# EAGLE design ControlPCB (EAGLE 9.6.2)
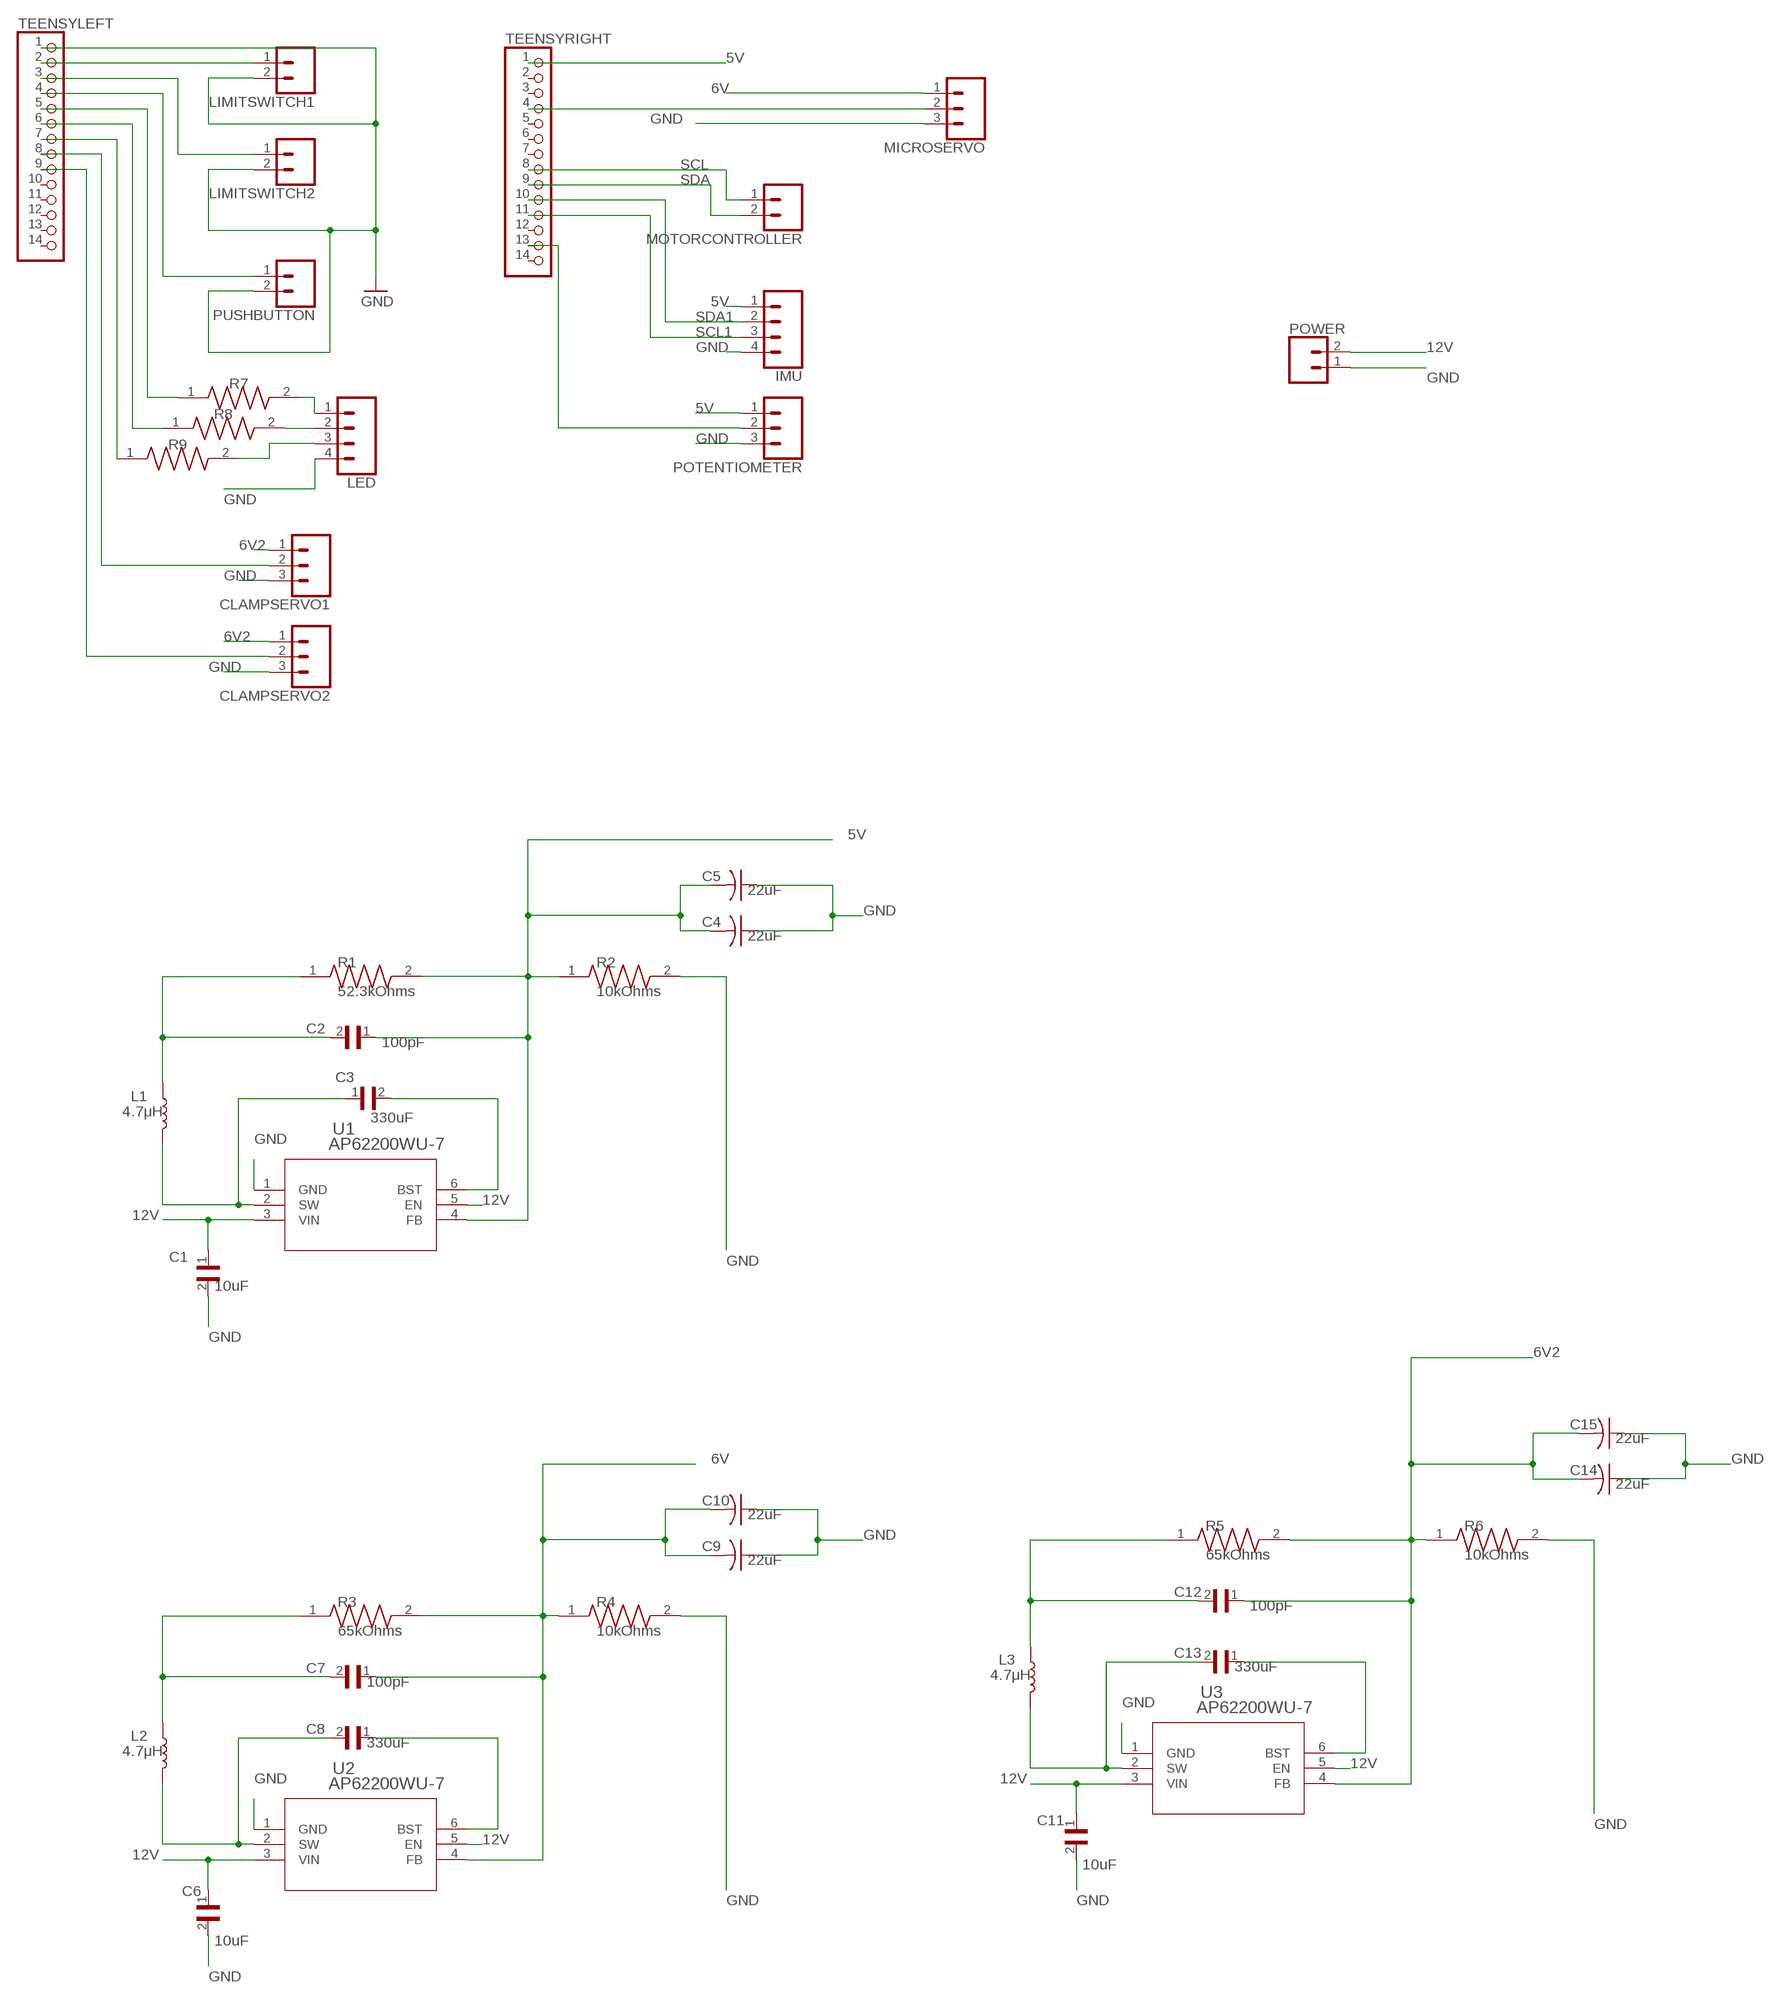
[diagram p0: schematic, sheet 1]

## Parts
C1  10uF  JMK107BJ106MA-T  [CAPC1608X90N]
C2  100pF  GRM033R71E101KA01D  [CAPC0603X33N]
C3  330uF  GRM32EC80E337ME05K  [CAPC3225X280N]
C4  22uF  C-USC0402  [C0402]
C5  22uF  C-USC0402  [C0402]
C6  10uF  JMK107BJ106MA-T  [CAPC1608X90N]
C7  100pF  GRM033R71E101KA01D  [CAPC0603X33N]
C8  330uF  GRM32EC80E337ME05K  [CAPC3225X280N]
C9  22uF  C-USC0402  [C0402]
C10  22uF  C-USC0402  [C0402]
C11  10uF  JMK107BJ106MA-T  [CAPC1608X90N]
C12  100pF  GRM033R71E101KA01D  [CAPC0603X33N]
C13  330uF  GRM32EC80E337ME05K  [CAPC3225X280N]
C14  22uF  C-USC0402  [C0402]
C15  22uF  C-USC0402  [C0402]
CLAMPSERVO1  CONN_03SCREW  [SCREWTERMINAL-3.5MM-3]
CLAMPSERVO2  CONN_03SCREW  [SCREWTERMINAL-3.5MM-3]
IMU  CONN_04SCREW  [SCREWTERMINAL-3.5MM-4]
L1  4.7μH  4.7μH_SHIELDED_INDUCTORNPIS_LS  [INDUCTOR_4X4MM]
L2  4.7μH  4.7μH_SHIELDED_INDUCTORNPIS_LS  [INDUCTOR_4X4MM]
L3  4.7μH  4.7μH_SHIELDED_INDUCTORNPIS_LS  [INDUCTOR_4X4MM]
LED  CONN_04SCREW  [SCREWTERMINAL-3.5MM-4]
LIMITSWITCH1  CONN_023.5MM  [SCREWTERMINAL-3.5MM-2]
LIMITSWITCH2  CONN_023.5MM  [SCREWTERMINAL-3.5MM-2]
MICROSERVO  CONN_03SCREW  [SCREWTERMINAL-3.5MM-3]
MOTORCONTROLLER  CONN_023.5MM  [SCREWTERMINAL-3.5MM-2]
POTENTIOMETER  CONN_03SCREW  [SCREWTERMINAL-3.5MM-3]
POWER  CONN_023.5MM  [SCREWTERMINAL-3.5MM-2]
PUSHBUTTON  CONN_023.5MM  [SCREWTERMINAL-3.5MM-2]
R1  52.3kOhms  ERJ1GNF1000C  [RES_ERJ1GNF1000C]
R2  10kOhms  ERJ1GNF1000C  [RES_ERJ1GNF1000C]
R3  65kOhms  ERJ1GNF1000C  [RES_ERJ1GNF1000C]
R4  10kOhms  ERJ1GNF1000C  [RES_ERJ1GNF1000C]
R5  65kOhms  ERJ1GNF1000C  [RES_ERJ1GNF1000C]
R6  10kOhms  ERJ1GNF1000C  [RES_ERJ1GNF1000C]
R7  100Ohm  ERJ1GNF1000C  [RES_ERJ1GNF1000C]
R8  100Ohm  ERJ1GNF1000C  [RES_ERJ1GNF1000C]
R9  100Ohm  ERJ1GNF1000C  [RES_ERJ1GNF1000C]
TEENSYLEFT  PINHD-1X14  [1X14]
TEENSYRIGHT  PINHD-1X14  [1X14]
U1  AP62200WU-7  [TSOT26-WU_DIO]
U2  AP62200WU-7  [TSOT26-WU_DIO]
U3  AP62200WU-7  [TSOT26-WU_DIO]

## Nets
5V: C2.1 C4.2 C5.2 IMU.1 POTENTIOMETER.1 R1.2 R2.1 TEENSYRIGHT.1 U1.4(FB)
6V: C7.1 C9.2 C10.2 MICROSERVO.1 R3.2 R4.1 U2.4(FB)
6V2: C12.1 C14.2 C15.2 CLAMPSERVO1.1 CLAMPSERVO2.1 R5.2 R6.1 U3.4(FB)
12V: C1.1 C6.1 C11.1 POWER.2 U1.3(VIN) U1.5(EN) U2.3(VIN) U2.5(EN) U3.3(VIN) U3.5(EN)
GND: C1.2 C4.1 C5.1 C6.2 C9.1 C10.1 C11.2 C14.1 C15.1 CLAMPSERVO1.3 CLAMPSERVO2.3 IMU.4 LED.4 LIMITSWITCH1.2 LIMITSWITCH2.2 MICROSERVO.3 POTENTIOMETER.3 POWER.1 PUSHBUTTON.2 R2.2 R4.2 R6.2 TEENSYLEFT.1 U1.1(GND) U2.1(GND) U3.1(GND)
N$1: LIMITSWITCH1.1 TEENSYLEFT.2
N$2: LIMITSWITCH2.1 TEENSYLEFT.3
N$3: PUSHBUTTON.1 TEENSYLEFT.4
N$4: MICROSERVO.2 TEENSYRIGHT.4
N$5: R7.1 TEENSYLEFT.5
N$6: R8.1 TEENSYLEFT.6
N$7: R9.1 TEENSYLEFT.7
N$8: CLAMPSERVO1.2 TEENSYLEFT.8
N$9: C2.2 L1.P$1 R1.1
N$10: C3.1 L1.P$2 U1.2(SW)
N$11: CLAMPSERVO2.2 TEENSYLEFT.9
N$12: C3.2 U1.6(BST)
N$13: C7.2 L2.P$1 R3.1
N$14: C8.2 L2.P$2 U2.2(SW)
N$15: POTENTIOMETER.2 TEENSYRIGHT.13
N$16: C8.1 U2.6(BST)
N$17: C12.2 L3.P$1 R5.1
N$18: C13.2 L3.P$2 U3.2(SW)
N$19: LED.1 R7.2
N$20: LED.2 R8.2
N$21: LED.3 R9.2
N$22: C13.1 U3.6(BST)
SCL: MOTORCONTROLLER.1 TEENSYRIGHT.8
SCL1: IMU.3 TEENSYRIGHT.11
SDA: MOTORCONTROLLER.2 TEENSYRIGHT.9
SDA1: IMU.2 TEENSYRIGHT.10
Unconnected: TEENSYLEFT.10 TEENSYLEFT.11 TEENSYLEFT.12 TEENSYLEFT.13 TEENSYLEFT.14 TEENSYRIGHT.2 TEENSYRIGHT.3 TEENSYRIGHT.5 TEENSYRIGHT.6 TEENSYRIGHT.7 TEENSYRIGHT.12 TEENSYRIGHT.14

## Library data of the parts
C1 C6 C11 = Capacitor10uF:JMK107BJ106MA-T: CAP SMT CER 10UF 6.3V 20% 0603 TAPE
C2 C7 C12 = Capacitor100pF:GRM033R71E101KA01D: SMD Capacitor X7R(EIA) with Capacitance: 100pF Tol. 10%. Rated Voltage: 25Vdc
C3 C8 C13 = GRM32EC80E337ME05K:GRM32EC80E337ME05K: SMD Capacitor X6S(EIA) with Capacitance: 330uF Tol. 20%. Rated Voltage: 2.5Vdc
C4 C5 C9 C10 C14 C15 = rcl:C-US: CAPACITOR, American symbol; SPICEPREFIX: C
CLAMPSERVO1 CLAMPSERVO2 MICROSERVO POTENTIOMETER = SparkFun-Connectors:CONN_03: Multi connection point. Often used as Generic Header-pin footprint for 0.1 inch spaced/style header connections On any of the 0.1 inch spaced packages, you can populate with these: Break Away Headers - Straight <https://www.sparkfun.com/products/116> (PRT-00116) Break Away Male Headers - Right Angle <https://www.sparkfun.com/products/553> (PRT-00553) Female Headers <https://www.sparkfun.com/products/115> (PRT-00115) Break Away Headers - Machine Pin <https://www.sparkfun.com/products/117> (PRT-00117) Break Away Female Headers - Swiss Machine Pin <https://www.sparkfun.com/products/743> (PRT-00743) Stackable Header - 3 Pin (Female, 0.1") <https://www.sparkfun.com/products/13875> (PRT-13875) For SCREWTERMINALS and SPRING TERMINALS visit here: Screw Terimnals on SparkFun.com <https://www.sparkfun.com/search/results?term=Screw+Terminals> (5mm/3.5mm/2.54mm spacing) This device is also useful as a general connection point to wire up your design to another part of your project. Our various solder wires solder well into these plated through hole pads. Hook-Up Wire - Assortment (Stranded, 22 AWG) <https://www.sparkfun.com/products/11375> (PRT-11375) Hook-Up Wire - Assortment (Solid Core, 22 AWG) <https://www.sparkfun.com/products/11367> (PRT-11367) View the entire wire category on our website here <https://www.sparkfun.com/categories/141> Special notes: Molex polarized connector foot print use with SKU : PRT-08232 with associated crimp pins and housings.; PROD_ID: CONN-08288; SF_ID: PRT-08235
IMU LED = SparkFun-Connectors:CONN_04: Multi connection point. Often used as Generic Header-pin footprint for 0.1 inch spaced/style header connections On any of the 0.1 inch spaced packages, you can populate with these: Break Away Headers - Straight <https://www.sparkfun.com/products/116> (PRT-00116) Break Away Male Headers - Right Angle <https://www.sparkfun.com/products/553> (PRT-00553) Female Headers <https://www.sparkfun.com/products/115> (PRT-00115) Break Away Headers - Machine Pin <https://www.sparkfun.com/products/117> (PRT-00117) Break Away Female Headers - Swiss Machine Pin <https://www.sparkfun.com/products/743> (PRT-00743) For SCREWTERMINALS and SPRING TERMINALS visit here: Screw Terimnals on SparkFun.com <https://www.sparkfun.com/search/results?term=Screw+Terminals> (5mm/3.5mm/2.54mm spacing) This device is also useful as a general connection point to wire up your design to another part of your project. Our various solder wires solder well into these plated through hole pads. Hook-Up Wire - Assortment (Stranded, 22 AWG) <https://www.sparkfun.com/products/11375> (PRT-11375) Hook-Up Wire - Assortment (Solid Core, 22 AWG) <https://www.sparkfun.com/products/11367> (PRT-11367) View the entire wire category on our website here <https://www.sparkfun.com/categories/141> Special notes: Molex polarized connector foot print use with SKU : PRT-08231 with associated crimp pins and housings. 1MM SMD Version SKU: PRT-10208; PROD_ID: CONN-14485
L1-L3 = SparkFun-Coils:4.7μH_SHIELDED_INDUCTOR: 4.7uH Inductor 4.7uH 1.4A 50mOhm 1008(2520) Package Shielded; PROD_ID: NDUC-15245
LIMITSWITCH1 LIMITSWITCH2 MOTORCONTROLLER POWER PUSHBUTTON = SparkFun-Connectors:CONN_02: Multi connection point. Often used as Generic Header-pin footprint for 0.1 inch spaced/style header connections On any of the 0.1 inch spaced packages, you can populate with these: Break Away Headers - Straight <https://www.sparkfun.com/products/116> (PRT-00116) Break Away Male Headers - Right Angle <https://www.sparkfun.com/products/553> (PRT-00553) Female Headers <https://www.sparkfun.com/products/115> (PRT-00115) Break Away Headers - Machine Pin <https://www.sparkfun.com/products/117> (PRT-00117) Break Away Female Headers - Swiss Machine Pin <https://www.sparkfun.com/products/743> (PRT-00743) For SCREWTERMINALS and SPRING TERMINALS visit here: Screw Terimnals on SparkFun.com <https://www.sparkfun.com/search/results?term=Screw+Terminals> (5mm/3.5mm/2.54mm spacing) This device is also useful as a general connection point to wire up your design to another part of your project. Our various solder wires solder well into these plated through hole pads. Hook-Up Wire - Assortment (Stranded, 22 AWG) <https://www.sparkfun.com/products/11375> (PRT-11375) Hook-Up Wire - Assortment (Solid Core, 22 AWG) <https://www.sparkfun.com/products/11367> (PRT-11367) View the entire wire category on our website here <https://www.sparkfun.com/categories/141> Special notes: Molex polarized connector foot print use with: PRT-08233 with associated crimp pins and housings. 2.54_SCREWTERM for use with PRT-10571. 3.5mm Screw Terminal footprints for PRT-08084 5mm Screw Terminal footprints for use with PRT-08432; PROD_ID: CONN-08399
R1-R9 = ERJ1GNF1000C:ERJ1GNF1000C; MANUFACTURER: Panasonic; MAXIMUM_PACKAGE_HEIGHT: 0.26mm; PARTREV: 22-Dec-22; STANDARD: Manufacturer Recommendations
TEENSYLEFT TEENSYRIGHT = pinhead:PINHD-1X14: PIN HEADER
U1-U3 = AP62200WU_7:AP62200WU-7; COPYRIGHT: Copyright (C) 2023 Ultra Librarian. All rights reserved.; MANUFACTURER_PART_NUMBER: AP62200WU-7; MFR_NAME: Diodes Inc

## Board
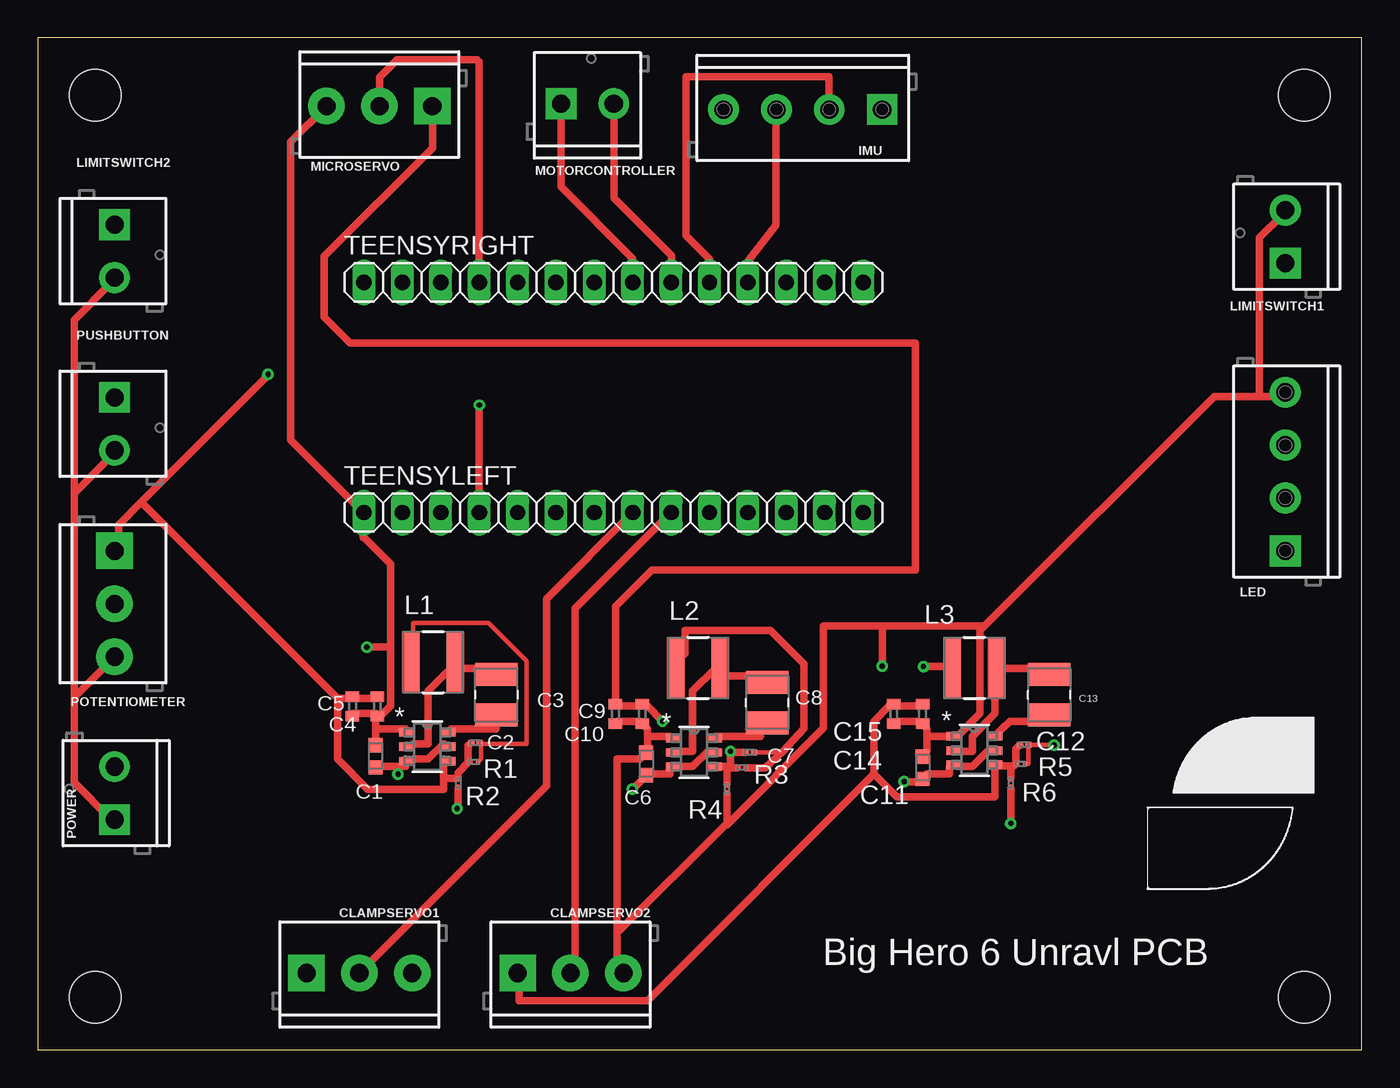
[diagram p1: board, top side]
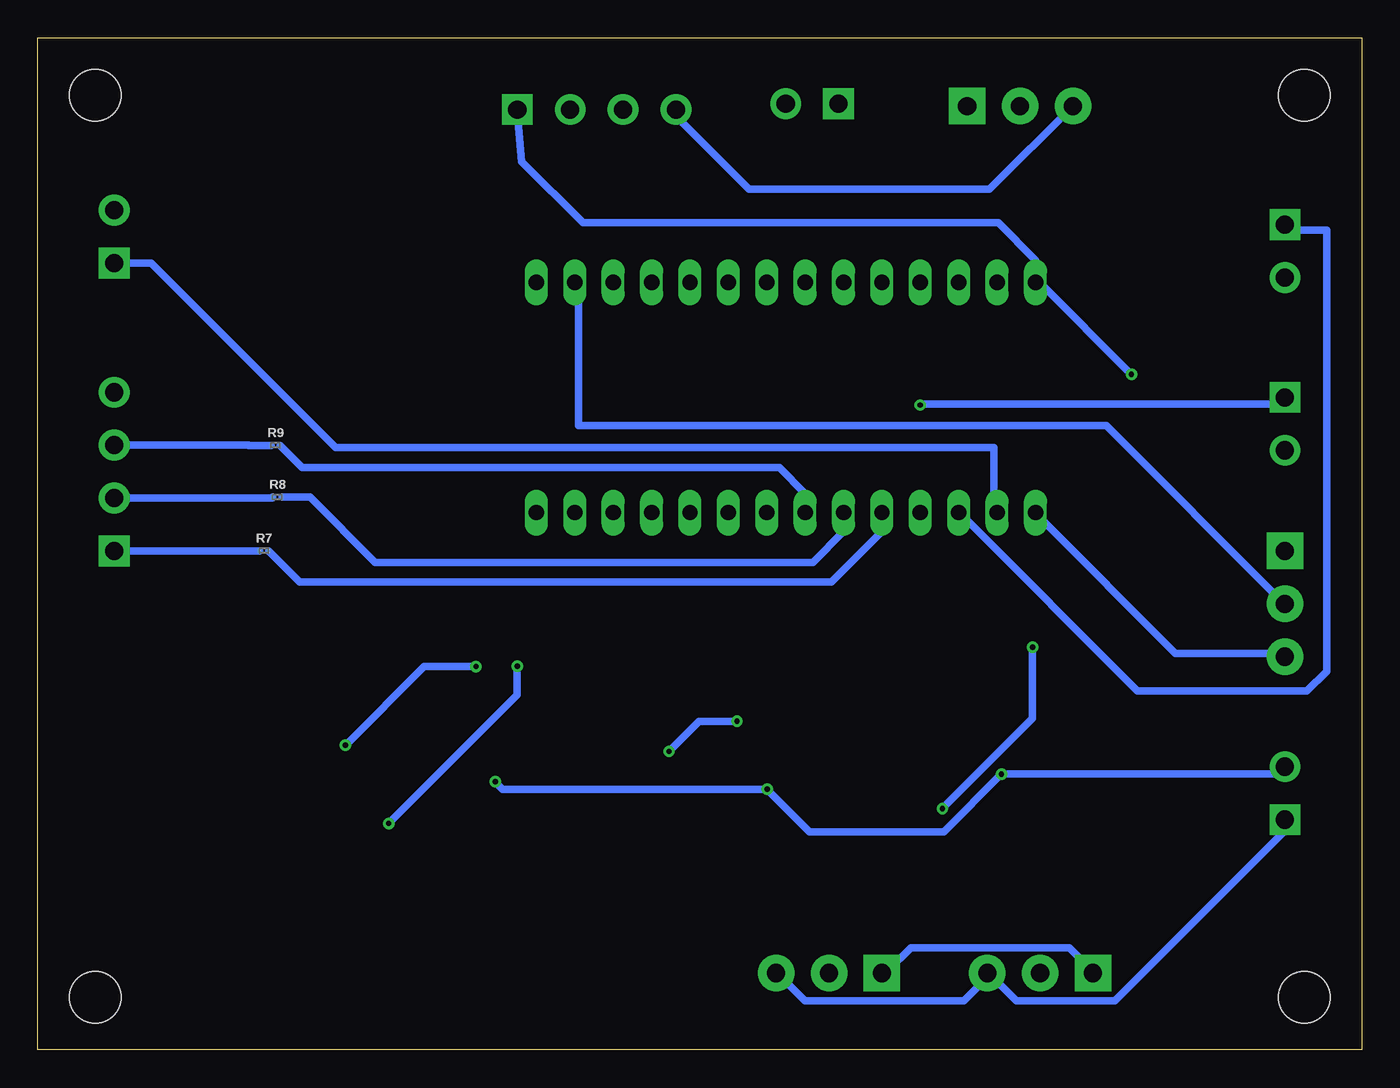
[diagram p2: board, bottom side, seen from below]

Size 87.61 x 66.98 mm. Coordinates in mm from the lower left corner, seen from the top.
Outline: 0,0 87.61,0 87.61,66.98 0,66.98 0,0
Copper layers (1*16): Top 0.035mm / dielectric 1.5mm / Bottom 0.035mm
Design rules "default *": minimum track width 0.1mm, minimum drill 0.35mm, track to track 0.1mm, track to pad 0.1mm, pad to pad 0.1mm, via to via 6mil, smd to smd 0.1mm, copper to edge 40mil, drill to drill 6mil, minimum pad ring 10mil, minimum via ring 8mil, stop-mask expansion 4mil, vias tented up to drill 0mil, thermal gap 10mil
Holes 3.4 mm at 83.82,3.48 83.82,63.17 3.81,3.48 3.81,63.17

### Footprints (pad centres in the part's own frame; a part is rotated, then mirrored left to right if it is on the bottom)
CAPC1608X90N = smd 0.95 x 0.93: 1 -0.738,0; 2 0.738,0
CAPC0603X33N = smd 0.38 x 0.4: 1 -0.281,0; 2 0.281,0
CAPC3225X280N = smd 1.53 x 2.81: 1 -1.341,0; 2 1.341,0
C0402 = smd 0.7 x 0.9: 1 -0.65,0; 2 0.65,0
SCREWTERMINAL-3.5MM-3 = drill 1.2 pad 2.413 square: 1 0,0 | drill 1.2 pad 2.413: 2 3.5,0; 3 7,0
SCREWTERMINAL-3.5MM-4 = drill 1.2 pad 2.032 square: 1 0,0 | drill 1.2 pad 2.032: 2 3.5,0; 3 7,0; 4 10.5,0
INDUCTOR_4X4MM = smd 4.089 x 1.143: P$1 0,1.473; P$2 0,-1.473
SCREWTERMINAL-3.5MM-2 = drill 1.2 pad 2.032 square: 1 0,0 | drill 1.2 pad 2.032: 2 3.5,0
RES_ERJ1GNF1000C = smd 0.25 x 0.3: 1 -0.3,0; 2 0.3,0
1X14 = drill 1.016 long: 1 -16.51,0; 2 -13.97,0; 3 -11.43,0; 4 -8.89,0; 5 -6.35,0; 6 -3.81,0; 7 -1.27,0; 8 1.27,0; 9 3.81,0; 10 6.35,0; 11 8.89,0; 12 11.43,0; 13 13.97,0; 14 16.51,0
TSOT26-WU_DIO = smd 1.003 x 0.559: 1 -1.353,0.95; 2 -1.353,0; 3 -1.353,-0.95; 4 1.353,-0.95; 5 1.353,0; 6 1.353,0.95

### Placement (x,y rotation side)
C1  22.35,19.43 90 top
C2  28.96,20.32 0 top
C3  30.35,23.5 270 top
C4  22.48,22.73 90 top
C5  20.83,22.73 90 top
C6  40.26,18.92 90 top
C7  47.12,19.69 0 top
C8  48.26,22.99 90 top
C9  38.23,22.23 90 top
C10  40,22.23 90 top
C11  58.55,18.67 90 top
C12  65.28,20.19 0 top
C13  66.93,23.5 90 top
C14  58.55,22.23 90 top
C15  56.64,22.23 90 top
CLAMPSERVO1  17.78,5.08 0 top
CLAMPSERVO2  31.75,5.08 0 top
IMU  55.88,62.23 180 top
L1  26.16,25.65 90 top
L2  43.69,25.27 90 top
L3  61.98,25.27 90 top
LED  82.55,33.02 90 top
LIMITSWITCH1  82.55,52.07 90 top
LIMITSWITCH2  5.08,54.61 270 top
MICROSERVO  26.11,62.46 180 top
MOTORCONTROLLER  34.62,62.61 0 top
POTENTIOMETER  5.08,33.02 270 top
POWER  5.08,15.24 90 top
PUSHBUTTON  5.08,43.18 270 top
R1  28.83,19.05 180 top
R2  27.81,17.65 270 top
R3  46.61,18.67 180 top
R4  45.59,17.27 270 top
R5  65.02,18.92 180 top
R6  64.39,17.65 270 top
R7  72.64,33.02 180 bottom
R8  71.76,36.58 180 bottom
R9  71.88,40.01 180 bottom
TEENSYLEFT  38.1,35.56 0 top
TEENSYRIGHT  38.1,50.8 0 top
U1  25.78,20.07 0 top
U2  43.43,19.69 0 top
U3  61.98,19.81 0 top

### Tracks (layer width: path | path; a pad name or v marks a point on that pad's centre or on a via)
5V  (via drill 0.35)
  Top 0.5: 20.84,23.25 22.34,23.25 C4.2 | 26.84,18.03 26.84,19.25 U1.4 | 26.84,18.03 26.84,17.25 21.84,17.25 19.84,19.25 19.84,23.25 | 19.84,23.25 20.84,23.25 | 20.84,23.25 C5.2 | 6.84,36.25 5.34,34.75 5.34,33.25 POTENTIOMETER.1 | 19.84,23.25 6.84,36.25 | 26.84,18.03 26.92,17.95 R2.1 27.81,18.33 28.49,19.01 | 28.49,19.01 R1.2 | C2.1 28.49,20.13 28.49,19.01 | 6.84,36.25 15.27,44.68 v15.24,44.7
  Bottom 0.5: IMU.1 55.59,58.78 51.54,54.73 24.05,54.73 21.59,52.27 TEENSYRIGHT.1 21.34,50.8 v15.24,44.7
6V  (via drill 0.35)
  Top 0.5: 45.84,18.75 45.59,18.75 | 45.59,18.75 44.84,18.75 U2.4 | 45.84,18.75 v45.84,19.75 45.91,19.68 C7.1 | v41.34,21.75 40.34,22.75 C10.2 39.84,22.75 38.34,22.75 C9.2 38.23,29.34 40.64,31.75 58.06,31.75 58.06,46.76 20.68,46.76 18.95,48.49 18.95,52.53 26.11,59.69 MICROSERVO.1 | 45.84,18.75 45.92,18.67 R3.2 | R4.1 45.59,18.75
  Bottom 0.5: v45.84,19.75 43.84,21.75 v41.34,21.75
6V2
  Top 0.5: C14.2 58.34,22.75 56.84,22.75 C15.2 56.34,22.75 55.34,21.75 55.34,18.25 | 63.34,18.75 63.34,16.75 56.84,16.75 55.34,18.25 | 63.34,18.75 U3.4 | 55.34,18.25 40.34,3.25 31.84,3.25 31.84,4.75 CLAMPSERVO2.1 | 64.39,18.8 63.39,18.8 63.34,18.75 | R6.1 64.39,18.8 | 64.39,18.8 64.6,18.8 R5.2 64.72,19.92 C12.1
  Bottom 0.5: CLAMPSERVO1.1 17.84,5.25 19.34,6.75 29.84,6.75 31.34,5.25 CLAMPSERVO2.1
12V  (via drill 0.35)
  Top 0.5: U3.5 62.84,19.75 61.84,18.75 60.84,18.75 U3.3 60.34,18.75 60.34,18.25 58.84,18.25 C11.1 58.34,17.75 v57.34,17.75 | 23.84,18.75 24.34,18.75 24.34,19.25 U1.3 24.84,19.25 25.84,19.25 26.84,20.25 U1.5 | 23.84,18.75 22.34,18.75 C1.1 | U2.5 44.34,19.75 43.34,18.75 42.34,18.75 U2.3 41.84,18.75 41.84,18.25 40.34,18.25 C6.1 39.84,17.75 v39.34,17.25 | v23.84,18.25 23.84,18.75
  Bottom 0.5: POWER.2 5.34,18.25 v23.84,18.25 27.65,14.44 36.53,14.44 v39.34,17.25 56.84,17.25 v57.34,17.75
GND  (via drill 0.35)
  Top 0.152: 21.6,33.91 21.54,33.91 | 21.54,35.51 TEENSYLEFT.1
  Top 0.5: C15.1 56.84,21.75 58.34,21.75 C14.1 58.84,21.25 58.84,20.75 | 58.84,20.75 58.84,19.75 C11.2 | 58.84,20.75 60.34,20.75 U3.1 60.84,20.75 62.34,22.25 62.34,27.75 62.65,28.05 | 62.65,28.05 77.84,43.25 80.84,43.25 | 80.84,43.25 82.34,43.25 LED.4 | 80.84,43.25 80.84,53.75 82.34,55.25 LIMITSWITCH1.2 | C9.1 38.34,21.75 39.84,21.75 C10.1 40.34,21.25 40.34,20.75 | 40.34,20.75 40.34,19.75 C6.2 39.84,19.25 38.34,19.25 38.34,7.75 | 40.34,20.75 41.84,20.75 U2.1 | 38.34,7.75 38.34,5.25 CLAMPSERVO2.3 | C5.1 20.84,22.25 22.34,22.25 C4.1 | 22.34,21.25 22.34,21.75 C4.1 | 22.34,21.25 22.34,20.25 C1.2 | 22.34,21.25 24.34,21.25 U1.1 | 23.34,26.67 23.34,32.17 21.6,33.91 | 23.34,26.67 23.34,22.75 22.84,22.25 C4.1 | TEENSYLEFT.1 21.84,35.25 16.74,40.35 16.74,60.09 MICROSERVO.3 | 2.4,23.31 2.4,17.69 4.84,15.25 POWER.1 | 2.4,23.31 4.84,25.75 POTENTIOMETER.3 | 2.4,36.81 4.84,39.25 PUSHBUTTON.2 | 2.4,23.31 2.4,36.81 | 2.4,36.81 2.4,48.31 4.84,50.75 LIMITSWITCH2.2 | 55.88,28.05 52,28.05 52,21.31 45.59,14.9 45.59,15 | 55.88,28.05 62.65,28.05 | 38.34,7.75 45.59,15 | R4.2 45.59,15 | R6.2 v64.39,14.99 | v55.88,25.4 55.88,28.05 | R2.2 27.81,16.04 v27.75,15.97 | v21.78,26.64 21.81,26.67 23.34,26.67 | 21.54,33.91 21.54,35.51
  Bottom 0.5: CLAMPSERVO2.3 38.34,4.75 36.84,3.25 26.34,3.25 24.84,4.75 CLAMPSERVO1.3 24.34,4.75 22.84,3.25 16.34,3.25 4.84,14.75 POWER.1 | IMU.4 45.34,61.75 40.54,56.95 24.62,56.95 MICROSERVO.3 | TEENSYLEFT.1 21.34,35.25 12.34,26.25 5.34,26.25 POTENTIOMETER.3 | v64.39,14.99 55.88,23.49 v55.88,25.4 | v27.75,15.97 21.78,21.94 v21.78,26.64
N$1
  Bottom 0.5: LIMITSWITCH1.1 80.12,52.07 67.91,39.86 24.34,39.86 24.34,35.75 TEENSYLEFT.2
N$2
  Bottom 0.5: TEENSYLEFT.3 26.34,35.25 14.83,23.74 3.63,23.74 2.32,25.05 2.32,54.25 4.84,54.25 LIMITSWITCH2.1
N$3  (via drill 0.35)
  Top 0.5: v29.21,42.67 TEENSYLEFT.4
  Bottom 0.5: v29.21,42.67 29.14,42.75 5.34,42.75 PUSHBUTTON.1
N$4
  Top 0.152: 29.08,65.53 29.21,65.4
  Top 0.5: MICROSERVO.2 22.61,64.37 23.77,65.53 29.08,65.53 | 29.21,65.4 TEENSYRIGHT.4
N$5
  Bottom 0.5: R7.1 70.29,30.96 35.08,30.96 31.75,34.29 TEENSYLEFT.5
N$6
  Bottom 0.5: R8.1 69.6,36.58 65.28,32.26 36.32,32.26 34.29,34.29 TEENSYLEFT.6
N$7
  Bottom 0.5: R9.1 70.11,38.53 38.53,38.53 36.83,36.83 TEENSYLEFT.7
N$8
  Top 0.5: CLAMPSERVO1.2 33.66,17.45 33.66,29.84 TEENSYLEFT.8
N$9
  Top 0.3: 29.34,20.25 32.34,20.25 32.34,25.75 29.84,28.25 24.84,28.25 24.84,25.69 | 29.34,20.25 C2.2 | R1.1 29.34,19.26 29.34,20.25
  Top 0.5: 24.84,25.69 L1.P$1
N$10
  Top 0.5: U1.2 24.84,20.25 25.84,20.25 25.84,23.75 27.62,25.53 L1.P$2 28.09,25.25 30.34,25.25 C3.1
N$11
  Top 0.5: CLAMPSERVO2.2 35.56,5.39 35.56,29.21 TEENSYLEFT.9
N$12
  Top 0.5: U1.6 27.34,21.25 30.34,21.25 30.34,21.75 C3.2
N$13
  Top 0.3: C7.2 49.25,19.68
  Top 0.5: 49.33,19.76 48.13,18.67 R3.1 | 49.33,19.76 50.7,21.27 50.7,25.55 48.5,27.75 42.84,27.75 42.84,26.25 42.34,25.75 L2.P$1 | 49.25,19.68 49.33,19.76
N$14
  Top 0.5: U2.2 42.34,19.75 43.34,19.75 43.34,23.75 44.84,25.25 L2.P$2 45.34,25.25 45.34,24.75 47.84,24.75 C8.2
N$15
  Bottom 0.5: TEENSYRIGHT.13 51.84,50.75 51.84,41.32 16.91,41.32 5.34,29.75 POTENTIOMETER.2
N$16
  Top 0.5: U2.6 44.84,20.75 47.84,20.75 47.84,21.25 C8.1
N$17  (via drill 0.35)
  Top 0.3: R5.1 65.56,18.92 C12.2 67.22,20.19
  Top 0.5: v58.61,25.37 60.41,25.37 L3.P$1 | 67.22,20.19 v67.25,20.16
  Bottom 0.5: v67.25,20.16 62.04,25.37 v58.61,25.37
N$18
  Top 0.5: U3.2 60.84,19.75 61.84,19.75 61.84,20.75 63.34,22.25 63.34,25.25 L3.P$2 63.84,25.25 66.84,25.25 C13.2
N$19
  Bottom 0.5: LED.1 R7.2
N$20
  Bottom 0.5: LED.2 72.11,36.52 R8.2
N$21
  Bottom 0.5: LED.3 73.66,40.02 73.65,40 R9.2
N$22
  Top 0.5: U3.6 63.83,21.26 64.32,21.75 66.84,21.75 C13.1
SCL
  Top 0.5: TEENSYRIGHT.8 39.37,52.37 34.62,57.12 MOTORCONTROLLER.1
SCL1
  Top 0.5: TEENSYRIGHT.11 46.99,52.2 48.84,54.58 48.84,61.75 IMU.3
SDA
  Top 0.152: 38.12,56.39 38.18,56.34 | 41.94,50.83 TEENSYRIGHT.9
  Top 0.5: MOTORCONTROLLER.2 38.12,56.39 | 38.18,56.34 41.94,52.58 41.94,50.83
SDA1
  Top 0.5: TEENSYRIGHT.10 44.45,52.32 42.89,53.88 42.89,64.41 52.34,64.41 52.34,62.25 IMU.2

### Text on the board
tPlace: Big Hero 6 Unravl PCB